# Altium schematic sheet Server SD & eMMC.schdoc
size 459 x 309 mm
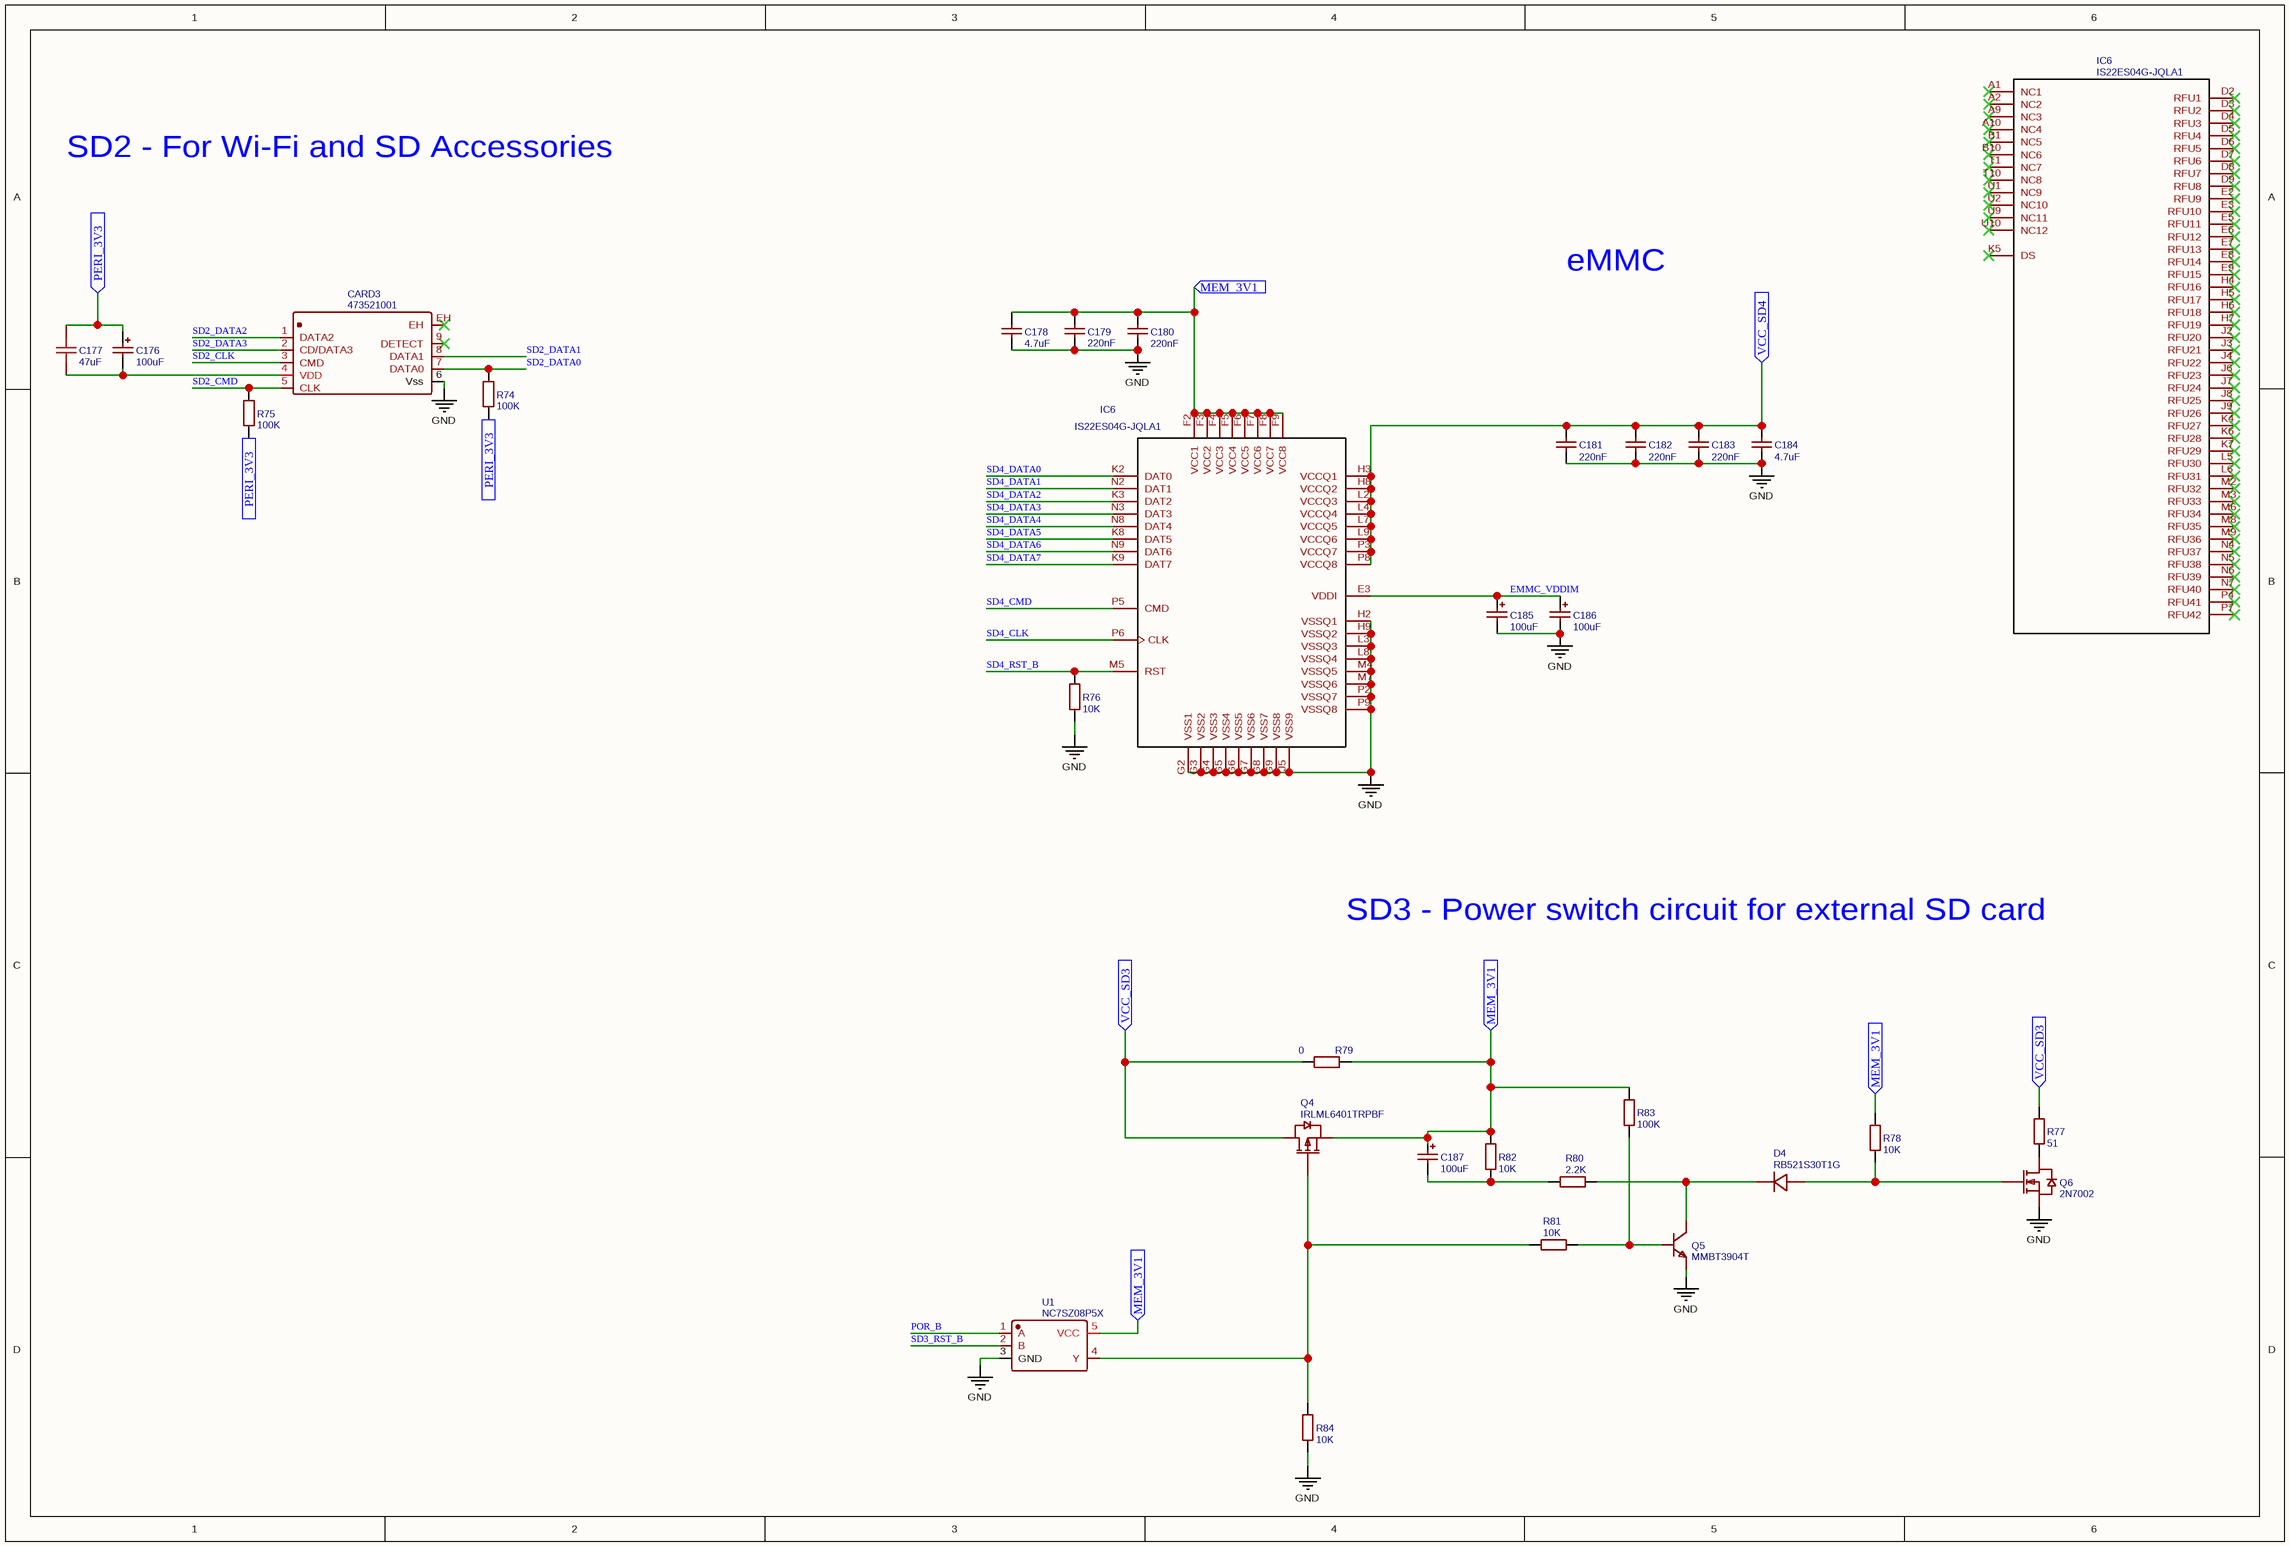
[diagram p0: Server SD & eMMC.schdoc]

## Parts
(Parts that share a designator on the sheet are numbered #1, #2 ... from top to bottom, then left to right.)
C176  100uF  [CAP-SMD_L7.3-W4.3-R-RD]
C177  47uF  [C1206]
C178  4.7uF  [C0402]
C179  220nF  [C0402]
C180  220nF  [C0402]
C181  220nF  [C0402]
C182  220nF  [C0402]
C183  220nF  [C0402]
C184  4.7uF  [C0402]
C185  100uF  [CAP-SMD_L7.3-W4.3-R-RD]
C186  100uF  [CAP-SMD_L7.3-W4.3-R-RD]
C187  100uF  [CAP-SMD_L7.3-W4.3-R-RD]
CARD3  473521001  [SD-SMD_SD-47352-101]
D4  RB521S30T1G  [SOD-523_L1.2-W0.8-LS1.6-RD]
IC6#1  IS22ES04G-JQLA1  [BGA100C100P10X17_1400X1800X140]
IC6#2  IS22ES04G-JQLA1  [BGA100C100P10X17_1400X1800X140]
Q4  IRLML6401TRPBF  [SOT-23-3_L2.9-W1.3-P1.90-LS2.4-BR]
Q5  MMBT3904T  [SOT-523-3_L1.6-W1.2-P1.00-LS1.6-BR]
Q6  2N7002  [SOT-23-3_L2.9-W1.3-P1.90-LS2.4-BR]
R74  100K  [R0805]
R75  100K  [R0805]
R76  10K  [R0402]
R77  51  [R0805]
R78  10K  [R0402]
R79  0  [R0402]
R80  2.2K  [R0402]
R81  10K  [R0402]
R82  10K  [R0402]
R83  100K  [R0402]
R84  10K  [R0402]
U1  NC7SZ08P5X  [SC-70-5_L2.1-W1.3-P0.65-LS2.1-BR]

## Ports
MEM_3V1 (in), PERI_3V3 (in), VCC_SD3 (in), VCC_SD4 (in)

## Nets
GND: C178.1 C179.1 C180.1 C181.1 C182.1 C183.1 C184.1 C185.2 C186.2 CARD3.6(Vss) IC6#2.G2(VSS1) IC6#2.G3(VSS2) IC6#2.G4(VSS3) IC6#2.G5(VSS4) IC6#2.G6(VSS5) IC6#2.G7(VSS6) IC6#2.G8(VSS7) IC6#2.G9(VSS8) IC6#2.H2(VSSQ1) IC6#2.H9(VSSQ2) IC6#2.J5(VSS9) IC6#2.L3(VSSQ3) IC6#2.L8(VSSQ4) IC6#2.M4(VSSQ5) IC6#2.M7(VSSQ6) IC6#2.P2(VSSQ7) IC6#2.P9(VSSQ8) Q5.2(E) Q6.2(S) R76.1 R84.2 U1.3(GND)
EMMC_VDDIM: C185.1 C186.1 IC6#2.E3(VDDI)
MEM_3V1: C178.2 C179.2 C180.2 C187.1 IC6#2.F2(VCC1) IC6#2.F3(VCC2) IC6#2.F4(VCC3) IC6#2.F5(VCC4) IC6#2.F6(VCC5) IC6#2.F7(VCC6) IC6#2.F8(VCC7) IC6#2.F9(VCC8) Q4.2(S) R78.2 R79.2 R82.1 R83.2 U1.5(VCC) ; port MEM_3V1
PERI_3V3: C176.1 C177.2 R74.1 R75.1 ; port PERI_3V3
POR_B: U1.1(A)
SD2_CLK: CARD3.3(CMD)
SD2_CMD: CARD3.5(CLK) R75.2
SD2_DATA0: CARD3.7(DATA0) R74.2
SD2_DATA1: CARD3.8(DATA1)
SD2_DATA2: CARD3.1(DATA2)
SD2_DATA3: CARD3.2(CD/DATA3)
SD3_RST_B: U1.2(B)
SD4_CLK: IC6#2.P6(CLK)
SD4_CMD: IC6#2.P5(CMD)
SD4_DATA0: IC6#2.K2(DAT0)
SD4_DATA1: IC6#2.N2(DAT1)
SD4_DATA2: IC6#2.K3(DAT2)
SD4_DATA3: IC6#2.N3(DAT3)
SD4_DATA4: IC6#2.N8(DAT4)
SD4_DATA5: IC6#2.K8(DAT5)
SD4_DATA6: IC6#2.N9(DAT6)
SD4_DATA7: IC6#2.K9(DAT7)
SD4_RST_B: IC6#2.M5(RST) R76.2
VCC_SD3: Q4.3(D) R77.2 R79.1 ; port VCC_SD3
VCC_SD4: C181.2 C182.2 C183.2 C184.2 IC6#2.H3(VCCQ1) IC6#2.H8(VCCQ2) IC6#2.L2(VCCQ3) IC6#2.L4(VCCQ4) IC6#2.L7(VCCQ5) IC6#2.L9(VCCQ6) IC6#2.P3(VCCQ7) IC6#2.P8(VCCQ8) ; port VCC_SD4
NetC176_2: C176.2 C177.1 CARD3.4(VDD)
NetC187_2: C187.2 R80.1 R82.2
NetD4_1: D4.1(C) Q5.3(C) R80.2
NetD4_2: D4.2(A) Q6.1(G) R78.1
NetQ4_1: Q4.1(G) R81.2 R84.1 U1.4(Y)
NetQ5_1: Q5.1(B) R81.1 R83.1
NetQ6_3: Q6.3(D) R77.1

Not connected (* = marked no-connect by the designer): CARD3 9(DETECT)* EH*; IC6#1 A1(NC1)* A2(NC2)* A9(NC3)* A10(NC4)* B1(NC5)* B10(NC6)* D2(RFU1)* D3(RFU2)* D4(RFU3)* D5(RFU4)* D6(RFU5)* D7(RFU6)* D8(RFU7)* D9(RFU8)* E2(RFU9)* E3(RFU10)* E5(RFU11)* E6(RFU12)* E7(RFU13)* E8(RFU14)* E9(RFU15)* H4(RFU16)* H5(RFU17)* H6(RFU18)* H7(RFU19)* J2(RFU20)* J3(RFU21)* J4(RFU22)* J6(RFU23)* J7(RFU24)* J8(RFU25)* J9(RFU26)* K4(RFU27)* K5(DS)* K6(RFU28)* K7(RFU29)* L5(RFU30)* L6(RFU31)* M2(RFU32)* M3(RFU33)* M6(RFU34)* M8(RFU35)* M9(RFU36)* N4(RFU37)* N5(RFU38)* N6(RFU39)* N7(RFU40)* P4(RFU41)* P7(RFU42)* T1(NC7)* T10(NC8)* U1(NC9)* U2(NC10)* U9(NC11)* U10(NC12)*

## Notes on the sheet
- SD2 - For Wi-Fi and SD Accessories
- eMMC
- SD3 - Power switch circuit for external SD card

## Library data of the parts
C176 C185-C187 = 100uF: BOM_Manufacturer: AVX; BOM_Manufacturer Part: TAJE107M025RNJ; nameAlias: Capacitance; SMT Type: Extend; BOM_Supplier: LCSC; BOM_Supplier Part: C7230; BOM_LCSC Assembly: Yes; spicePre: C; spiceSymbolName: TAJE107M025RNJ
C177 = 47uF: BOM_Manufacturer: SAMSUNG; BOM_Manufacturer Part: CL31A476MPHNNNE; nameAlias: Capacitance; SMT Type: Basic; BOM_Supplier: LCSC; BOM_Supplier Part: C96123; BOM_LCSC Assembly: Yes; spicePre: C; spiceSymbolName: CL31A476MPHNNNE
C178 C184 = 4.7uF: BOM_Manufacturer Part: CL05A475MP5NRNC; BOM_Manufacturer: SAMSUNG; nameAlias: Capacitance; SMT Type: Basic; BOM_Supplier: LCSC; BOM_LCSC Assembly: Yes; BOM_Supplier Part: C23733; spicePre: C; spiceSymbolName: CL05A475MP5NRNC
C179-C183 = 220nF: BOM_Manufacturer Part: CL05B224KO5NNNC; BOM_Manufacturer: SAMSUNG; nameAlias: Capacitance; SMT Type: Basic; BOM_Supplier: LCSC; BOM_LCSC Assembly: Yes; BOM_Supplier Part: C16772; spicePre: C; spiceSymbolName: CL05B224KO5NNNC
CARD3 = 473521001: BOM_Manufacturer: MOLEX; Contributor: LCSC; BOM_Supplier: LCSC; BOM_Supplier Part: C293569; BOM_Manufacturer Part: 473521001; spicePre: C; spiceSymbolName: 473521001
D4 = RB521S30T1G: BOM_Manufacturer: ON Semicon; Contributor: LCSC; SMT Type: Extend; BOM_Supplier: LCSC; BOM_Supplier Part: C145179; BOM_Manufacturer Part: RB521S30T1G; BOM_LCSC Assembly: Yes; spicePre: D; spiceSymbolName: RB521S30T1G
IC6#1 IC6#2 = IS22ES04G-JQLA1: subpart_no: 1; Contributor: Ke'Ondrae_Mell; spicePre: I; spiceSymbolName: IS22ES04G-JQLA1
Q4 = IRLML6401TRPBF: BOM_Manufacturer: IR; SMT Type: Extend; BOM_Supplier: LCSC; BOM_Manufacturer Part: IRLML6401TRPBF; image: //image.lceda.cn/szlcsc/C3034.jpg; BOM_Supplier Part: C3034; BOM_LCSC Assembly: Yes; spicePre: Q; spiceSymbolName: IRLML6401TRPBF
Q5 = MMBT3904T: BOM_Manufacturer: CJ; SMT Type: Extend; BOM_Supplier: LCSC; BOM_Manufacturer Part: MMBT3904T; image: //image.lceda.cn/szlcsc/C61616.jpg; BOM_Supplier Part: C61616; BOM_LCSC Assembly: Yes; spicePre: Q; spiceSymbolName: MMBT3904T
Q6 = 2N7002: BOM_Manufacturer: CJ; SMT Type: Basic; BOM_Supplier: LCSC; BOM_Manufacturer Part: 2N7002; BOM_LCSC Assembly: Yes; image: //image.lceda.cn/szlcsc/C8545.jpg; BOM_Supplier Part: C8545; spicePre: Q; spiceSymbolName: 2N7002
R74 R75 = 100K: BOM_Manufacturer: UniOhm; BOM_Manufacturer Part: 0805W8F1003T5E; nameAlias: Resistance (Ohms); SMT Type: Basic; BOM_Supplier: LCSC; BOM_LCSC Assembly: Yes; BOM_Supplier Part: C17407; spicePre: R; spiceSymbolName: 0805W8F1003T5E
R76 R78 R81 R82 R84 = 10K: BOM_Manufacturer: UniOhm; BOM_Manufacturer Part: 0402WGF1002TCE; nameAlias: Resistance (Ohms); SMT Type: Basic; BOM_Supplier: LCSC; BOM_LCSC Assembly: Yes; BOM_Supplier Part: C25744; spicePre: R; spiceSymbolName: 0402WGF1002TCE
R77 = 51: BOM_Manufacturer: FH; BOM_Manufacturer Part: RS-05K510JT; nameAlias: Resistance (Ohms); BOM_Supplier: LCSC; BOM_Supplier Part: C139859; spicePre: R; spiceSymbolName: RS-05K510JT
R79 = 0: BOM_Manufacturer: KOA; BOM_Manufacturer Part: RK73Z1ETTP; nameAlias: Resistance (Ohms); BOM_Supplier: LCSC; BOM_Supplier Part: C131359; spicePre: R; spiceSymbolName: RK73Z1ETTP
R80 = 2.2K: BOM_Manufacturer: UniOhm; BOM_Manufacturer Part: 0402WGF2201TCE; nameAlias: Resistance (Ohms); SMT Type: Basic; BOM_Supplier: LCSC; BOM_LCSC Assembly: Yes; BOM_Supplier Part: C25879; spicePre: R; spiceSymbolName: 0402WGF2201TCE
R83 = 100K: BOM_Manufacturer: UniOhm; BOM_Manufacturer Part: 0402WGF1003TCE; nameAlias: Resistance (Ohms); SMT Type: Basic; BOM_Supplier: LCSC; BOM_LCSC Assembly: Yes; BOM_Supplier Part: C25741; spicePre: R; spiceSymbolName: 0402WGF1003TCE
U1 = NC7SZ08P5X: BOM_Manufacturer: ON Semicon; Contributor: LCSC; SMT Type: Extend; BOM_Supplier: LCSC; BOM_Supplier Part: C128377; BOM_Manufacturer Part: NC7SZ08P5X; BOM_LCSC Assembly: Yes; spicePre: U; spiceSymbolName: NC7SZ08P5X